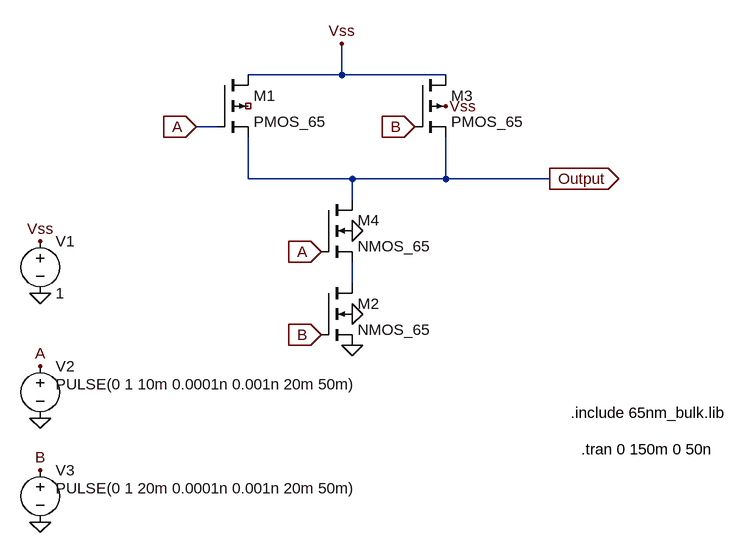
[diagram p0: schematic m_case2.asc]
m_case2.asc, the LTspice schematic file:
Version 4
SHEET 1 880 680
WIRE 224 -144 224 -192
WIRE 224 -144 80 -144
WIRE 384 -144 224 -144
WIRE 32 -64 0 -64
WIRE 80 16 80 -48
WIRE 240 16 80 16
WIRE 384 16 384 -48
WIRE 384 16 240 16
WIRE 544 16 384 16
WIRE 240 48 240 16
WIRE 240 176 240 144
FLAG -240 112 Vss
FLAG -240 192 0
FLAG 240 224 0
FLAG 224 -192 Vss
FLAG 240 272 0
FLAG 544 16 Output
IOPIN 544 16 Out
FLAG -240 384 0
FLAG 384 -96 Vss
FLAG 240 96 0
FLAG 192 256 B
IOPIN 192 256 In
FLAG -240 304 A
FLAG -240 544 0
FLAG -240 464 B
FLAG 192 128 A
IOPIN 192 128 In
FLAG 0 -64 A
IOPIN 0 -64 In
FLAG 336 -64 B
IOPIN 336 -64 In
SYMBOL pmos4 32 -144 R0
SYMATTR InstName M1
SYMATTR Value2 l=65n w=2600n
SYMATTR Value PMOS_65
SYMBOL nmos4 192 176 R0
SYMATTR InstName M2
SYMATTR Value2 l=65n w=1300n
SYMATTR Value NMOS_65
SYMBOL voltage -240 96 R0
WINDOW 123 0 0 Left 0
WINDOW 39 0 0 Left 0
SYMATTR InstName V1
SYMATTR Value 1
SYMBOL voltage -240 288 R0
WINDOW 123 0 0 Left 0
WINDOW 39 0 0 Left 0
WINDOW 3 24 44 Left 2
SYMATTR Value PULSE(0 1 10m 0.0001n 0.001n 20m 50m)
SYMATTR InstName V2
SYMBOL pmos4 336 -144 R0
SYMATTR InstName M3
SYMATTR Value2 l=65n w=2600n
SYMATTR Value PMOS_65
SYMBOL nmos4 192 48 R0
SYMATTR InstName M4
SYMATTR Value2 l=65n w=1300n
SYMATTR Value NMOS_65
SYMBOL voltage -240 448 R0
WINDOW 123 0 0 Left 0
WINDOW 39 0 0 Left 0
WINDOW 3 24 44 Left 2
SYMATTR Value PULSE(0 1 20m 0.0001n 0.001n 20m 50m)
SYMATTR InstName V3
TEXT 592 432 Left 2 !.tran 0 150m 0 50n
TEXT 576 376 Left 2 !.include 65nm_bulk.lib

The netlist it stands for:
* m_case2.asc
M1 Vss A Output NC_01 PMOS_65 l=65n w=2600n
M2 N001 B 0 0 NMOS_65 l=65n w=1300n
V1 Vss 0 1
V2 A 0 PULSE(0 1 10m 0.0001n 0.001n 20m 50m)
M3 Vss B Output Vss PMOS_65 l=65n w=2600n
M4 Output A N001 0 NMOS_65 l=65n w=1300n
V3 B 0 PULSE(0 1 20m 0.0001n 0.001n 20m 50m)
.model NMOS NMOS
.model PMOS PMOS
.lib standard.mos
.tran 0 150m 0 50n
.include 65nm_bulk.lib
.backanno
.end